# Altium schematic sheet P1.schdoc (part 3 of 3)
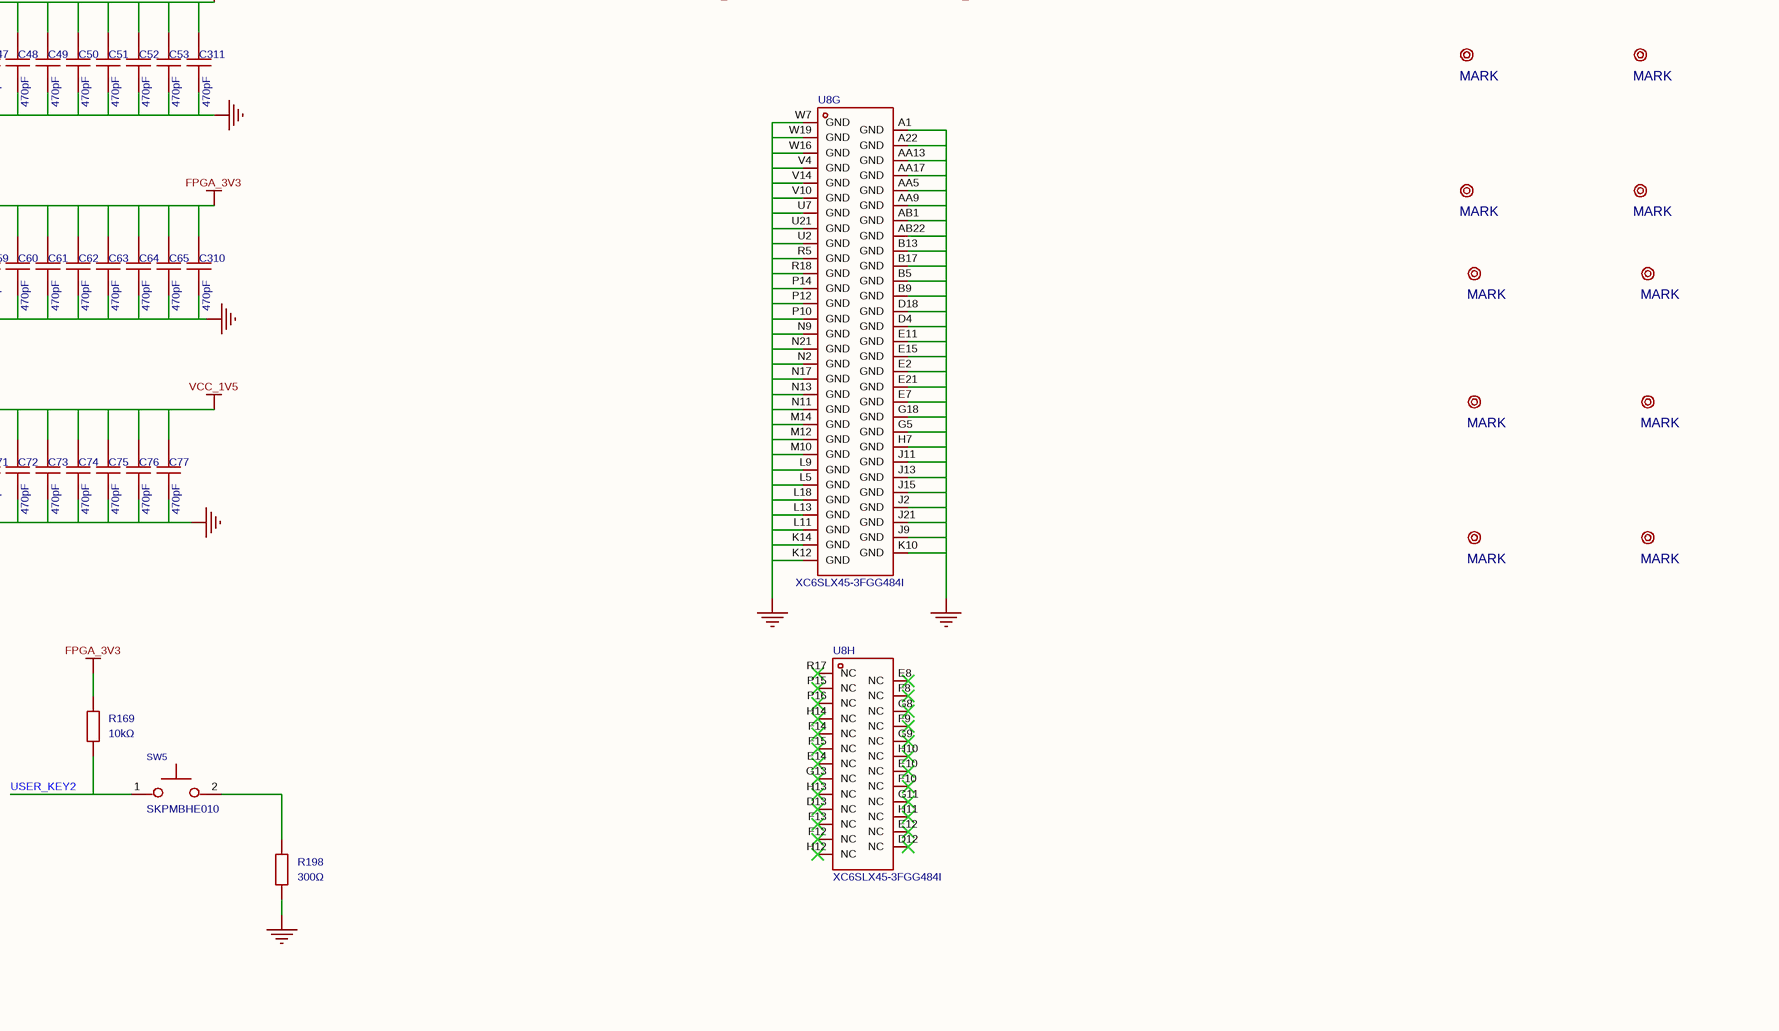
[diagram p13: P1.schdoc, bottom column 4 of 4]

## Library data of the parts (continued)
SW3-SW5 = SKPMBHE010: 电路结构:单刀单掷;按钮形状:圆形按钮;安装方式:立贴;开关长度:6mm;开关宽度:5.9mm;开关高度:5mm;触点电流:50mA;额定电压(DC):16V;带灯:-;机械寿命:-;; Manufacturer: ALPSALPINE(阿尔卑斯阿尔派); AddInBom: yes; ModelId: be0d10cf1ad744bda11cb4858781af3b; ModelName: KEY-SMD_2P-L6.0-W6.0-H5.0-P6.00; ModelTransform: 259.82917,236.22,0,0,0,0,0,0,0; Circuit: 单刀单掷; Actuator Style: 圆形按钮; Switch Length: 6mm; Switch Width: 5.9mm; Switch Height: 5mm; Contact Current: 50mA; Voltage Rating (DC): 16V; Symbol: SKPMBHE010; Device: SKPMBHE010; Supplier: LCSC; Manufacturer Part: SKPMBHE010; Supplier Part: C115350; JLCPCB Part Class: 扩展库; LCSC Part Name: 6*5.9*5mm 立贴 轻触开关; Supplier Footprint: SMD; Datasheet: https://atta.szlcsc.com/upload/public/pdf/source/20170620/1497944811941.pdf; ConvertToPcb: yes; FootprintName: KEY-SMD_2P-L6.0-W6.0-P6.00; Mounting Style: 立贴; With Lamp: -; Mechanical Life: -
U2 = TFP401APZPR: Manufacturer: TI(德州仪器); AddInBom: yes; ModelId: e83df82de3c64625ab006609cd73c7d5; ModelName: HTQFP-100_L14.0-W14.0-H1.20-P0.50-LS16.0-BL-EP6.2; ModelTransform: 645.668,645.668,0,0,0,0,0,0,0; Symbol: TFP401APZPR; Device: TFP401APZPR; Supplier: LCSC; Supplier Part: C962083; Manufacturer Part: TFP401APZPR; JLCPCB Part Class: 扩展库; LCSC Part Name: TFP401APZPR; Supplier Footprint: HTQFP-100(14x14); Datasheet: https://www.ti.com/cn/lit/gpn/tfp401a; ConvertToPcb: yes; FootprintName: HTQFP-100_L14.0-W14.0-P0.50-LS16.0-BL-EP6.2
U3 = TFP410PAPR: TFP410 165MHz TMDS DVI 变送器/串行器和 Panelbus™ 集成电路; Manufacturer: TI(德州仪器); AddInBom: yes; ModelId: 357debac5b0843a7959e030fa4cca68f; ModelTransform: 472.44,472.44,0,0,0,0,0,0,0; Symbol: TFP410PAPR; Device: TFP410PAPR; Supplier: LCSC; Supplier Part: C7498519; Manufacturer Part: TFP410PAPR; LCSC Part Name: TFP410PAPR; Supplier Footprint: HTQFP-64; Datasheet: https://atta.szlcsc.com/upload/public/pdf/source/20230810/DC1BCF8EBEBC0D028FF881990074CBDF.pdf; ConvertToPcb: yes; FootprintName: HTQFP-64_L10.0-W10.0-P0.50-LS12.0-BL-EP5.0; ModelName: HTQFP-64_L10.0-W10.0-P0.50-LS12.0-BL-EP5.0
U4 = ADV7125BCPZ170-RL: Manufacturer: ADI(亚德诺); AddInBom: yes; ModelId: 2c3ecfc50fad4bda8013b44284106549; ModelName: LFCSP-48_L7.0-W7.0-H0.8-P0.50; ModelTransform: 275.591,275.591,0,90,0,0,0,0,0; Symbol: ADV7125BCPZ170-RL; Device: ADV7125BCPZ170-RL; LCSC Part Name: ADV7125BCPZ170-RL; SupplierPart: C662235; ManufacturerPart: ADV7125BCPZ170-RL; Supplier Footprint: LFCSP-48(7x7); JLCPCB Part Class: 扩展库; Datasheet: https://atta.szlcsc.com/upload/public/pdf/source/20200623/C662235_F54F032DAD30FD9F79111A17EFAC1480.pdf; Supplier: LCSC; ConvertToPcb: yes; FootprintName: LFCSP-48_L7.0-W7.0-P0.50-BL-EP5.1; Operating Temperature: -40℃~+85℃
U5 U12 = MT41K256M16TW-107:P: 商业级; Manufacturer: micron(镁光); AddInBom: yes; ModelId: 09c921600e1b4bd985a2e4282350750e; ModelName: FBGA-96_L14.0-W8.0-H1.1-P0.8; ModelTransform: 314.96,551.18,0,0,0,0,0,0,0; Symbol: MT41K256M16TW-107:P; Device: MT41K256M16TW-107:P; Supplier: LCSC; Supplier Part: C253882; Manufacturer Part: MT41K256M16TW-107:P; JLCPCB Part Class: 扩展库; LCSC Part Name: MT41K256M16TW-107:PTR; Supplier Footprint: TFBGA-96; Datasheet: https://atta.szlcsc.com/upload/public/pdf/source/20190702/C253882_073A45851B86D33155EFFA955E523761.pdf; ConvertToPcb: yes; FootprintName: FBGA-96_L14.0-W8.0-R16-C6-P0.80-TL
U7 = TPS51200DRCR: 输出电压:-;; Manufacturer: TI(德州仪器); AddInBom: yes; ModelId: 41266ffa534b4b0386eb0067a4f6d1a2; ModelName: WSON-10_L3.0-W3.0-H1.0-P0.50; ModelTransform: 118.8974,118.8974,0,90,0,0,0,0,0; Number of Outputs: 1; Switch tube (built-in/external): 内置; Symbol: TPS51200DRCR; Device: TPS51200DRCR; Supplier: LCSC; Manufacturer Part: TPS51200DRCR; Supplier Part: C34771; JLCPCB Part Class: 扩展库; LCSC Part Name: TPS51200DRCR; Supplier Footprint: VSON-10-EP(3x3); Datasheet: https://www.ti.com/cn/lit/gpn/tps51200; ConvertToPcb: yes; FootprintName: WSON-10_L3.0-W3.0-P0.50-BL-EP; Output Voltage: -; Operating Temperature: -40℃~+85℃
U8 = XC6SLX45-3FGG484I: Manufacturer: XILINX(赛灵思); AddInBom: yes; ModelId: 3abebaa3ee4f462aa6190f543be940e9; ModelTransform: 905.51,905.51,0,0,0,0,0,0,0; Symbol: XC6SLX45-3FGG484I; Device: XC6SLX45-3FGG484I; LCSC Part Name: XC6SLX45 3FGG484I -; SupplierPart: C1521774; ManufacturerPart: XC6SLX45-3FGG484I; Supplier Footprint: FBGA-484; JLCPCB Part Class: 扩展库; Datasheet: https://atta.szlcsc.com/upload/public/pdf/source/20190708/C40678_8062B8DC60CC400C51EC6675AD18673A.pdf; Supplier: LCSC; ConvertToPcb: yes; FootprintName: FBGA-484_L23.0-W23.0-R22-C22-P1.00-TL; ModelName: FBGA-484_L23.0-W23.0-R22-C22-P1.00-TL
U11 U72-U76 = 1625854-2: PC 测试点 表面贴装; Manufacturer: TE Connectivity(泰科电子); AddInBom: yes; ModelId: bfbdca37223f416e80526217787ecd09; ModelTransform: 78.74,49.2125,0,0,0,0,0,0,0; Symbol: 1625854-2; Device: 1625854-2; LCSC Part Name: 1625854-2; SupplierPart: C306063; ManufacturerPart: 1625854-2; Supplier Footprint: -; JLCPCB Part Class: 扩展库; Datasheet: https://atta.szlcsc.com/upload/public/pdf/source/20221209/97BE41A51F1CE3ECBA7573F39B62A732.pdf; Supplier: LCSC; ConvertToPcb: yes; FootprintName: TEST-RING; ModelName: TEST-RING
U13 = AD1580ARTZ-REEL7: 输出类型:固定;输入电压:-;输出电压:1.225V;输出电流:10mA;精度:±0.82%;; Manufacturer: ADI(亚德诺); AddInBom: yes; ModelId: 89cb27a44ab2466697082bb9fd73a7d0; ModelName: SOT-23-3L_L2.9-W1.6-H1.1-LS2.8-P0.95; ModelTransform: 114.173,110.236,0,90,0,0,0,0,0; Output Type: 固定; Output Voltage: 1.225V; Output Current: 10mA; Tolerance: ±0.82%; Temperature Coefficient: 100ppm/℃; Reference Type: 并联; Noise - 1/10Hz to 10Hz: 5uVp-p; Noise - 10Hz to 10kHz: 20uVrms; Symbol: AD1580ARTZ-REEL7; Device: AD1580ARTZ-REEL7; LCSC Part Name: AD1580ARTZ-REEL7; SupplierPart: C9819; ManufacturerPart: AD1580ARTZ-REEL7; Supplier Footprint: SOT-23; JLCPCB Part Class: 扩展库; Datasheet: https://atta.szlcsc.com/upload/public/pdf/source/20161207/1481104217379.pdf; Supplier: LCSC; ConvertToPcb: yes; FootprintName: SOT-23-3_L2.9-W1.6-P1.90-LS2.8-BR; Input Voltage: -; Supply Current: -; Operating Temperature: -40℃~+85℃@(Ta)
U14 = RT0402BRE0750RL: 电阻类型:薄膜电阻;阻值:50Ω;精度:±0.1%;功率:62.5mW;温度系数:±50ppm/℃;; Manufacturer: YAGEO(国巨); AddInBom: yes; ModelId: 671aefced39d4c318694bba8bd8efd39; ModelName: R0402_L1.0-W0.5-H0.5; ModelTransform: 39.37,19.685,0,0,0,0,0,0.0005,0; Tolerance: ±0.1%; Power(Watts): 62.5mW; Symbol: RT0402BRE0750RL; Device: RT0402BRE0750RL; LCSC Part Name: 薄膜电阻 50Ω ±0.1% 62.5mW; SupplierPart: C853312; ManufacturerPart: RT0402BRE0750RL; Supplier Footprint: 0402; JLCPCB Part Class: 扩展库; Datasheet: https://atta.szlcsc.com/upload/public/pdf/source/20200610/C326738_5639A9F1B6EB6E4AE2197577D3456E7F.pdf; Supplier: LCSC; ConvertToPcb: yes; FootprintName: R0402; Type: 薄膜电阻; Value: 50Ω; Temperature Coefficient: ±50ppm/℃; Operating Temperature Range: -55℃~+155℃
U15-U17 U22 U23 = BLM18PG121SN1D: 标称阻抗@测试频率:120Ω@100MHz;误差:±25%;直流电阻(RDC):50mΩ;; Manufacturer: muRata(村田); Symbol: BLM18PG121SN1D_C14709; AddInBom: yes; ModelId: 2bc5ec593d464d6ba9807aec0b5673c2; ModelName: L0603_L1.6-W0.8-H0.5_BEAD; ModelTransform: 62.992,31.496,0,180,0,0,0.094,0.629,0; Tolerance: ±25%; DC Resistance: 50mΩ; Current Rating: 2A; Circuits: 1; Device: BLM18PG121SN1D; LCSC Part Name: 单路 0603磁珠 阻抗120Ω@100MHz; SupplierPart: C14709; ManufacturerPart: BLM18PG121SN1D; Supplier Footprint: 0603; JLCPCB Part Class: 扩展库; Datasheet: https://atta.szlcsc.com/upload/public/pdf/source/20130704/1457706621422.pdf; Supplier: LCSC; ConvertToPcb: yes; FootprintName: L0603; Impedance @ Frequency: 120Ω@100MHz
U18 U24 = 1812L160PR: 最大电压:8V;最大电流:100A;保持电流:1.6A;跳闸电流:2.8A;; Manufacturer: Littelfuse(美国力特); AddInBom: yes; ModelId: bca21e458c564d38b781621ca22e660b; ModelName: F1812_L4.5-W3.2-H1.0; ModelTransform: 177.165,125.984,0,0,0,0,0.0005,0,0; Operating Voltage (Max): 8V; Current Rating (Max): 100A; Hold Current: 1.6A; Trip Current: 2.8A; Resistance - Initial (Ri) (Min): 30mΩ; Resistance - Post Trip (R1) (Max): 100mΩ; Maximum Time to Trip: 1s; Symbol: 1812L160PR; Device: 1812L160PR; LCSC Part Name: 8V 1.6A 1812自恢复; SupplierPart: C207073; ManufacturerPart: 1812L160PR; Supplier Footprint: 1812; JLCPCB Part Class: 扩展库; Datasheet: https://atta.szlcsc.com/upload/public/pdf/source/20181031/C315901_C3D1AA68B7E2FCFB6B7163300867CF3D.pdf; Supplier: LCSC; ConvertToPcb: yes; FootprintName: F1812; Power Dissipation: -; Operating Temperature: -40℃~+85℃
U19 = P82B96TD,118: 类型:缓冲器；驱动器;通道数:2;应用:I2C;; Manufacturer: NXP(恩智浦); AddInBom: yes; ModelId: e81d2f7d937b4a6ab1dca543ff5d56a4; ModelName: SOIC-8_L4.9-W3.9-H1.7-LS6.0-P1.27; ModelTransform: 189.751,236.22,0,0,0,0,0.0005,0.0005,0; Input Type: 2线式总线; Supply Voltage: 2V~15V; Number of Channels: 2; Data Rate: 400Kbps; Input Capacitance: 7pF; Symbol: P82B96TD,118; Device: P82B96TD,118; LCSC Part Name: P82B96TD,118; SupplierPart: C32103; ManufacturerPart: P82B96TD,118; Supplier Footprint: SOIC-8; JLCPCB Part Class: 扩展库; Datasheet: https://atta.szlcsc.com/upload/public/pdf/source/20140618/1457707093915.pdf; Supplier: LCSC; ConvertToPcb: yes; FootprintName: SOIC-8_L4.9-W3.9-P1.27-LS6.0-BL; Type: 缓冲器；驱动器; Output Type: 2线式总线; Delay Time: -; Signal Conditioning: -; Operating Temperature: -40℃~+85℃; Application: I2C
U21 U25-U27 U31 U101 U102 U121 U122 = RT0603BRE075KL: 电阻类型:薄膜电阻;阻值:5kΩ;精度:±0.1%;功率:100mW;温度系数:±50ppm/℃;; Manufacturer: YAGEO(国巨); AddInBom: yes; ModelId: fc143cca1e79419f9cd78b61e9279f08; ModelTransform: 31.8897,63.7794,0,90,0,0,0,0,0; Tolerance: ±0.1%; Power(Watts): 100mW; Symbol: RT0603BRE075KL; Device: RT0603BRE075KL; LCSC Part Name: 薄膜电阻 5kΩ ±0.1% 100mW; SupplierPart: C862232; ManufacturerPart: RT0603BRE075KL; Supplier Footprint: 0603; JLCPCB Part Class: 扩展库; Datasheet: https://atta.szlcsc.com/upload/public/pdf/source/20200610/C326738_5639A9F1B6EB6E4AE2197577D3456E7F.pdf; Supplier: LCSC; ConvertToPcb: yes; FootprintName: R0603; ModelName: R0603; Type: 薄膜电阻; Value: 5kΩ; Temperature Coefficient: ±50ppm/℃; Operating Temperature Range: -55℃~+155℃
U33 = AT24C02C-SSHM-T: 接口类型:I2C;存储容量:2Kbit;; Manufacturer: MICROCHIP(美国微芯); AddInBom: yes; ModelId: e81d2f7d937b4a6ab1dca543ff5d56a4; ModelName: SOIC-8_L4.9-W3.9-H1.7-LS6.0-P1.27; ModelTransform: 189.751,236.22,0,0,0,0,-0.0005,0.0005,0; Interface Type: I2C; Memory Size: 2Kbit; Supply Voltage: 1.7V~5.5V; Symbol: AT24C02C-SSHM-T; Device: AT24C02C-SSHM-T; LCSC Part Name: AT24C02C-SSHM-T; SupplierPart: C6203; ManufacturerPart: AT24C02C-SSHM-T; Supplier Footprint: SOIC-8; JLCPCB Part Class: 扩展库; Datasheet: https://atta.szlcsc.com/upload/public/pdf/source/20150601/1457707316447.pdf; Supplier: LCSC; ConvertToPcb: yes; FootprintName: SOIC-8_L5.0-W4.0-P1.27-LS6.0-BL; Operating Temperature: -40℃~+85℃
U69 U70 = TPS62130ARGTT: Manufacturer: TI(德州仪器); AddInBom: yes; ModelId: 7a2e4d0d3f334e78b4387183d1ce0547; ModelTransform: 118.8974,118.8974,0,0,0,0,0,0,0; Symbol: TPS62130ARGTT; Device: TPS62130ARGTT; Supplier: LCSC; Supplier Part: C2070679; Manufacturer Part: TPS62130ARGTT; JLCPCB Part Class: 扩展库; LCSC Part Name: TPS62130ARGTT; Supplier Footprint: QFN-16-EP(3x3); Datasheet: https://www.ti.com/cn/lit/gpn/tps62131; ConvertToPcb: yes; FootprintName: TQFN-16_L3.0-W3.0-P0.50-TL-EP1.7; ModelName: TQFN-16_L3.0-W3.0-P0.50-TL-EP1.7
U71 = TPS54620RHLR: 功能类型:降压型;输出类型:可调;输入电压:4.5V~17V;输出电压:800mV~15V;输出电流(最大值):6A;; Manufacturer: TI(德州仪器); AddInBom: yes; ModelId: 65ab631f0b46483ca36f8d8ba5bd0cf9; ModelName: VQFN-14_L3.5-W3.5-H1.0-P0.50-TL; ModelTransform: 138.5824,138.5824,0,270,0,0,0.004,-0.004,0; Function: 降压型; Output Type: 可调; Output Current (Max): 6A; Switching Frequency: 1.6MHz; Synchronous Rectification: 是; Number of Outputs: 1; Topology: 降压式; Switch tube (built-in/external): 内置; Symbol: TPS54620RHLR; Device: TPS54620RHLR; Supplier: LCSC; Supplier Part: C263274; Manufacturer Part: TPS54620RHLR; JLCPCB Part Class: 扩展库; LCSC Part Name: TPS54620RHLR; Supplier Footprint: VQFN-14-EP(3.5x3.5); Datasheet: https://www.ti.com/cn/lit/gpn/tps54620; ConvertToPcb: yes; FootprintName: VQFN-14_L3.5-W3.5-P0.50-TL-EP_TPS54622RHLT; Input Voltage: 4.5V~17V; Output Voltage: 800mV~15V; Operating Temperature: -40℃~+150℃@(TJ)
U77-U81 = APT3216SGC: 发光颜色:翠绿色;正向电压(VF):2.2V;正向电流:20mA;主波长:568nm;透镜颜色:无色透明透镜;发光强度:12mcd;发光角度:120°;; Manufacturer: Kingbright; AddInBom: yes; ModelId: 25c52fe4797543dba3be0628b2a2389b; ModelTransform: 118.18874,59.4487,0,0,0,0,0,0,0; Emitted Color: 翠绿色; Forward Voltage (VF): 2.2V; Forward Current: 20mA; Dominant Wavelength: 568nm; Peak Wavelength: 565nm; Lens Color: 无色透明透镜; Luminous Intensity: 12mcd; Viewing Angle: 120°; Symbol: APT3216SGC; Device: APT3216SGC; LCSC Part Name: APT3216SGC; SupplierPart: C5875760; ManufacturerPart: APT3216SGC; Supplier Footprint: 1206; JLCPCB Part Class: 扩展库; Datasheet: https://atta.szlcsc.com/upload/public/pdf/source/20240417/40CF3267DD1033400CB26B372702289F.pdf; Supplier: LCSC; ConvertToPcb: yes; FootprintName: LED1206-RD; ModelName: LED1206-RD
U82-U85 = SMTSO3050CTJ: M3x5.56xL5+1.53; Manufacturer: Sinhoo(雄和远景); AddInBom: yes; specifications: M3X5; surface treatment: 镀锡; ModelId: c0272a1083aa488a8080554edf29f67b; ModelTransform: 218.897,218.387,0,0,0,0,-0.155,-0.01,-59.055; Symbol: SMTSO3050CTJ; Device: SMTSO3050CTJ; Supplier: LCSC; SupplierPart: C2915636; ManufacturerPart: SMTSO3050CTJ; JLCPCB Part Class: 扩展库; LCSC Part Name: 雄和远景，电路板表贴圆螺母柱，M3X5，铜镀锡,1个; Supplier Footprint: -; Datasheet: https://atta.szlcsc.com/upload/public/pdf/source/20211122/17CF5E24EB4D4DC090A80DE3D7DE5E21.pdf; ConvertToPcb: yes; Product Description: -; material quality: -; model: SMTSO3050CTJ; brand: Sinhoo(雄和远景); FootprintName: SMD_SMTSO3060CTJ; ModelName: SMD_SMTSO3060CTJ
U86-U99 = MARK: Convert to PCB: yes; AddInBom: no; Symbol: MARK; Device: MARK; FootprintName: MARK
U100 = SN74LVC1G06MDCKREP: 电源电压:1.65V~5.5V;供电电流(最大值):10uA;电路数:1;最大传播延迟(tpd):5.5ns@5V,50pF;; Manufacturer: TI(德州仪器); AddInBom: yes; ModelId: 180ad2a85d044b18a9defb4b28abe560; ModelTransform: 78.74,86.614,0,0,0,0,-0.002,0.001,0; Supply Current (Max): 10uA; Number of Circuits: 1; Sink Current: 32mA; High level range (VIH): 1.07V~3.85V; Low level range (VIL): 580mV~1.65V; Symbol: SN74LVC1G06MDCKREP; Device: SN74LVC1G06MDCKREP; LCSC Part Name: SN74LVC1G06MDCKREP; SupplierPart: C2871364; ManufacturerPart: SN74LVC1G06MDCKREP; Supplier Footprint: SC-70-5; JLCPCB Part Class: 扩展库; Datasheet: https://www.ti.com/cn/lit/gpn/sn74lvc1g06-ep; Supplier: LCSC; ConvertToPcb: yes; FootprintName: SC-70-5_L2.0-W1.3-P0.65-LS2.1-BL; ModelName: SC-70-5_L2.0-W1.3-P0.65-LS2.1-BL; Supply Voltage(Single): 1.65V~5.5V; Number of Inputs: 1; Max Propagation Delay: 5.5ns@5V,50pF; Series: 74LVC系列; Operating Temperature: -55℃~+125℃
U123 = W25Q128JVSIQ: 接口类型:-;存储容量:128Mbit;时钟频率(fc):-;; Manufacturer: WINBOND(华邦); Symbol: W25Q128JVSIQTR; AddInBom: yes; ModelId: f83d990ad74f400caf5ac920b7771508; ModelName: SOIC-8_L5.3-W5.3-H1.9-LS7.9-P1.27; ModelTransform: 208.661,311.25654,0,0,0,0,-0.0005,0.0005,0; Device: W25Q128JVSIQ; LCSC Part Name: W25Q128JVSIQ 编带; SupplierPart: C97521; ManufacturerPart: W25Q128JVSIQ; Supplier Footprint: SOIC-8-208mil; JLCPCB Part Class: 基础库; Datasheet: https://atta.szlcsc.com/upload/public/pdf/source/20170316/1489627409956.pdf; Supplier: LCSC; ConvertToPcb: yes; FootprintName: SOIC-8_L5.3-W5.3-P1.27-LS8.0-BL; Interface Type: -; Memory Size: 128Mbit; Clock Frequency (fc): -; Supply Voltage: -; Supply Current (Read): -; Supply Current (Program): -; Supply Current (Erase): -; Standby supply current: -; Page Programming Time (Tpp): -; Block Erase Time (tBE): -; Data Retention - TDR (Year): -; Operating Temperature: -
USB2 USB3 = HDMI-001C_C2836126: 连接器类型:HDMI;公母:母;总PIN位数:19P;安装方式:弯插;排数:2;额定电流:500mA;触头材质:-;触头镀层:-;工作温度范围:-45℃~+85℃;; Manufacturer: XUNPU(讯普); AddInBom: yes; ModelId: 600865d6f4bd4fcf80f101b6337483c3; ModelTransform: 303.149,909.447,0,90,0,0,163.386,0,-149.606; Connector Type: HDMI; Gender: 母; Current Rating (Max): 500mA; Symbol: HDMI-001C_C2836126; Device: HDMI-001C_C2836126; Supplier: LCSC; Supplier Part: C2836126; Manufacturer Part: HDMI-001C; JLCPCB Part Class: 扩展库; LCSC Part Name: HDMI 母 P数:19P; Supplier Footprint: 弯插; Datasheet: https://atta.szlcsc.com/upload/public/pdf/source/20200810/C720617_FFAEEC9A8F7AC9847E6A422865303F15.pdf; ConvertToPcb: yes; FootprintName: HDMI-SMD_HDMI-001C; ModelName: HDMI-SMD_HDMI-001C; Number of Pins: 19P; Mounting Style: 弯插; Number of Rows: 2; Contact Material: -; Contact Plating: -; Operating Temperature Range: -45℃~+85℃
X1 = OT2EL4C4JI-111OLP-27M: 频率:27MHz;常温频差:±10ppm;输出模式:CMOS;工作电压:1.8V~3.3V;; Manufacturer: YXC(扬兴晶振); AddInBom: yes; ModelId: ae22b8d143894765bc8100c37cb6356f; ModelName: OSC-SMD_4P-L3.2-W2.5-H1.0; ModelTransform: 125.984,98.425,0,0,0,0,0,0,0; Normal temperature Frequency Tolerance: ±10ppm; Output Type: CMOS; Symbol: OT2EL4C4JI-111OLP-27M; Device: OT2EL4C4JI-111OLP-27M; Supplier: LCSC; Supplier Part: C5203549; Manufacturer Part: OT2EL4C4JI-111OLP-27M; Value: 27MHz; JLCPCB Part Class: 扩展库; LCSC Part Name: 27MHZ 1.8V-3.3V ±10PPM YSO110TR; Supplier Footprint: SMD3225-4P; Datasheet: https://atta.szlcsc.com/upload/public/pdf/source/20221021/93BE0275F36E6561B802C10A6737F13A.pdf; ConvertToPcb: yes; FootprintName: OSC-SMD_4P-L3.2-W2.5-BL; Supply Voltage: 1.8V~3.3V; Operating Temperature: -40℃~+85℃
X2 = SG-8018CE 50.000000MHz TJHPA: 频率:50MHz;输出模式:CMOS;工作电压:1.62V~3.63V;供电电流:8.1mA;频率稳定度(全温):±50ppm;; Manufacturer: EPSON(爱普生); Symbol: SG-8018CE-50.000000MHZ-TJHPA; AddInBom: yes; ModelId: ae22b8d143894765bc8100c37cb6356f; ModelName: OSC-SMD_4P-L3.2-W2.5-H1.0; ModelTransform: 125.984,98.425,0,0,0,0,0,0,0; Output Type: CMOS; Supply Current (Max): 8.1mA; Frequency Stability(Full temperature range): ±50ppm; Device: SG-8018CE 50.000000MHz TJHPA; Supplier: LCSC; Supplier Part: C390511; Manufacturer Part: SG-8018CE 50.000000MHz TJHPA; Value: 50MHz; JLCPCB Part Class: 扩展库; LCSC Part Name: 50MHz 2.6V 方波; Supplier Footprint: SMD3225-4P; Datasheet: https://atta.szlcsc.com/upload/public/pdf/source/20190626/C390511_81901DCBAD43204E1117389204FD22BB.pdf; ConvertToPcb: yes; FootprintName: OSC-SMD_4P-L3.2-W2.5-BL; Supply Voltage: 1.62V~3.63V; Operating Temperature: -40℃~+105℃